# EAGLE board Tractive System Board Rev4 (EAGLE 9.6.2)
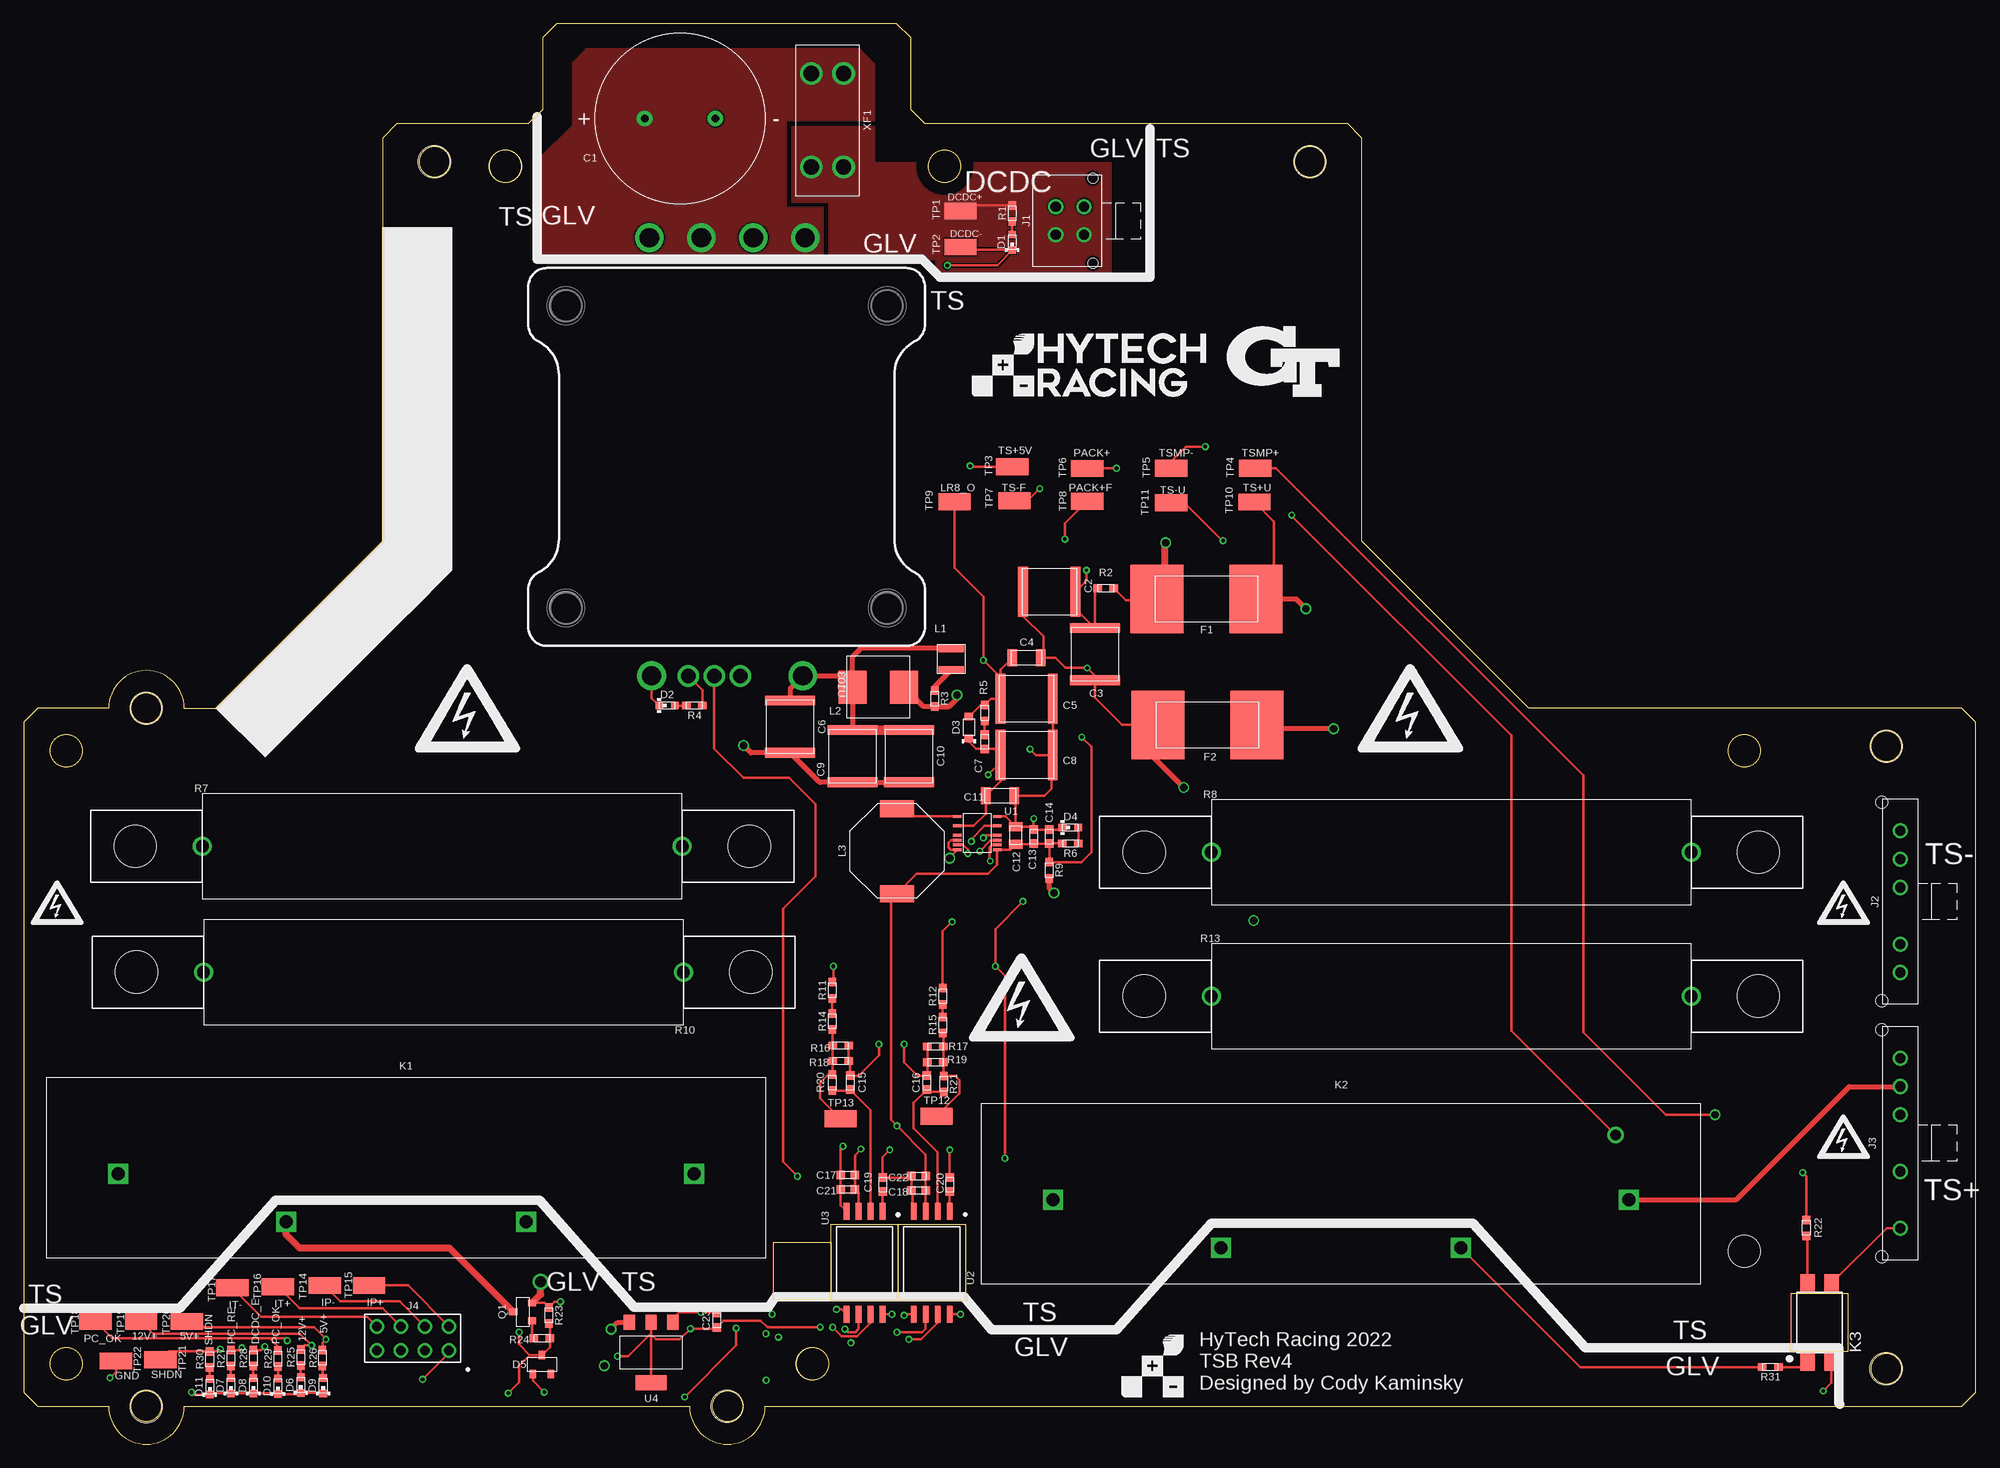
[diagram p4: board, top side]
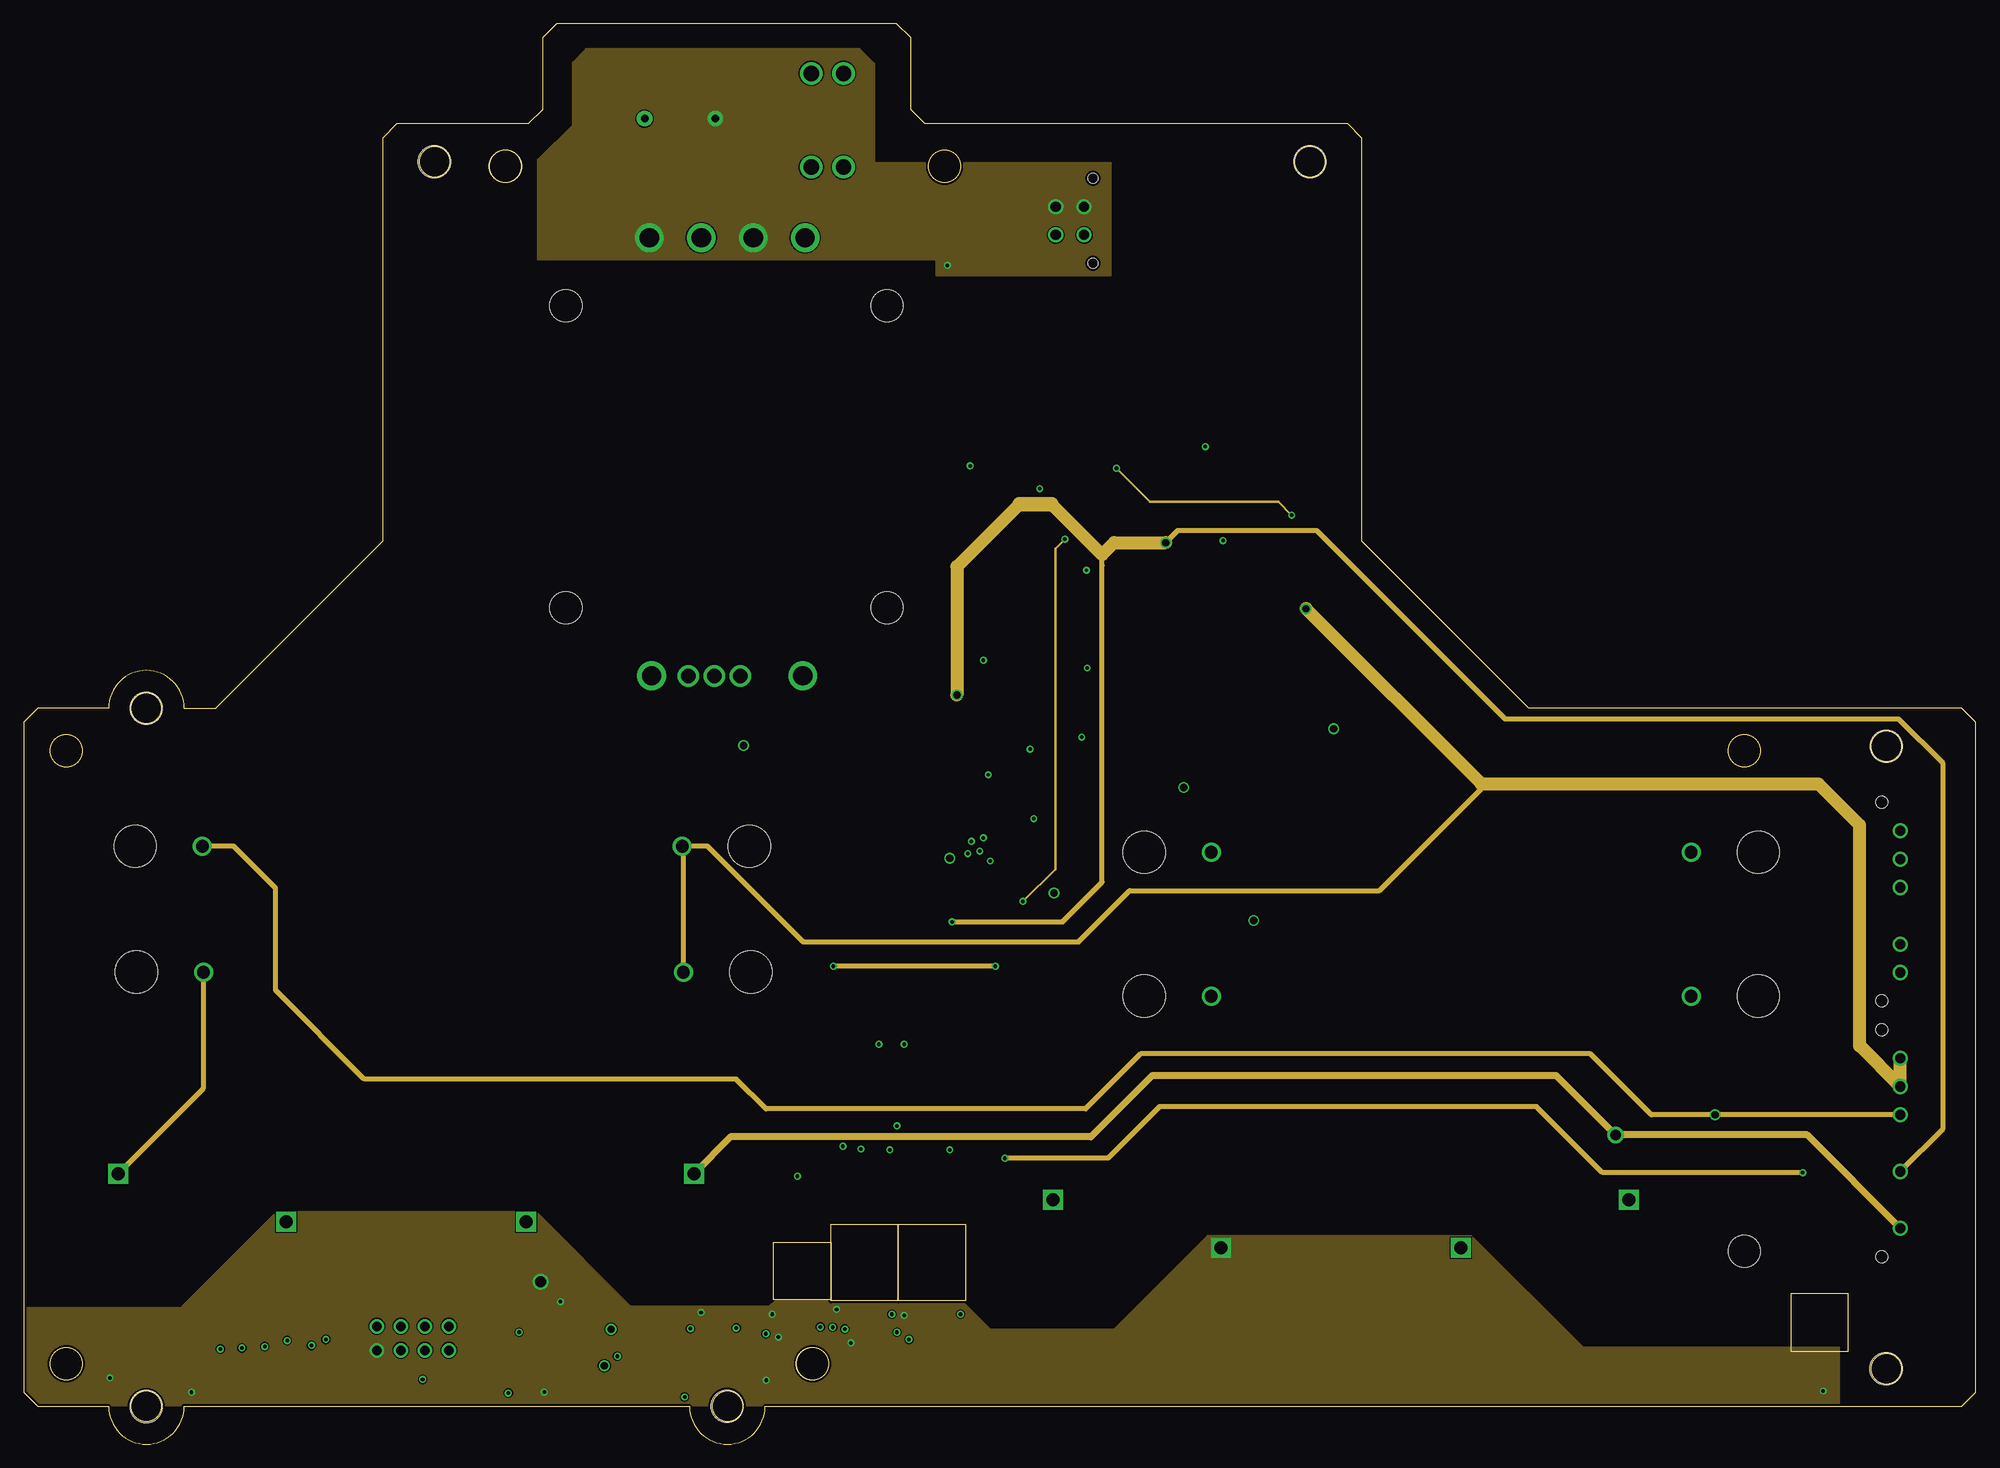
[diagram p5: board, inner layer Route2]
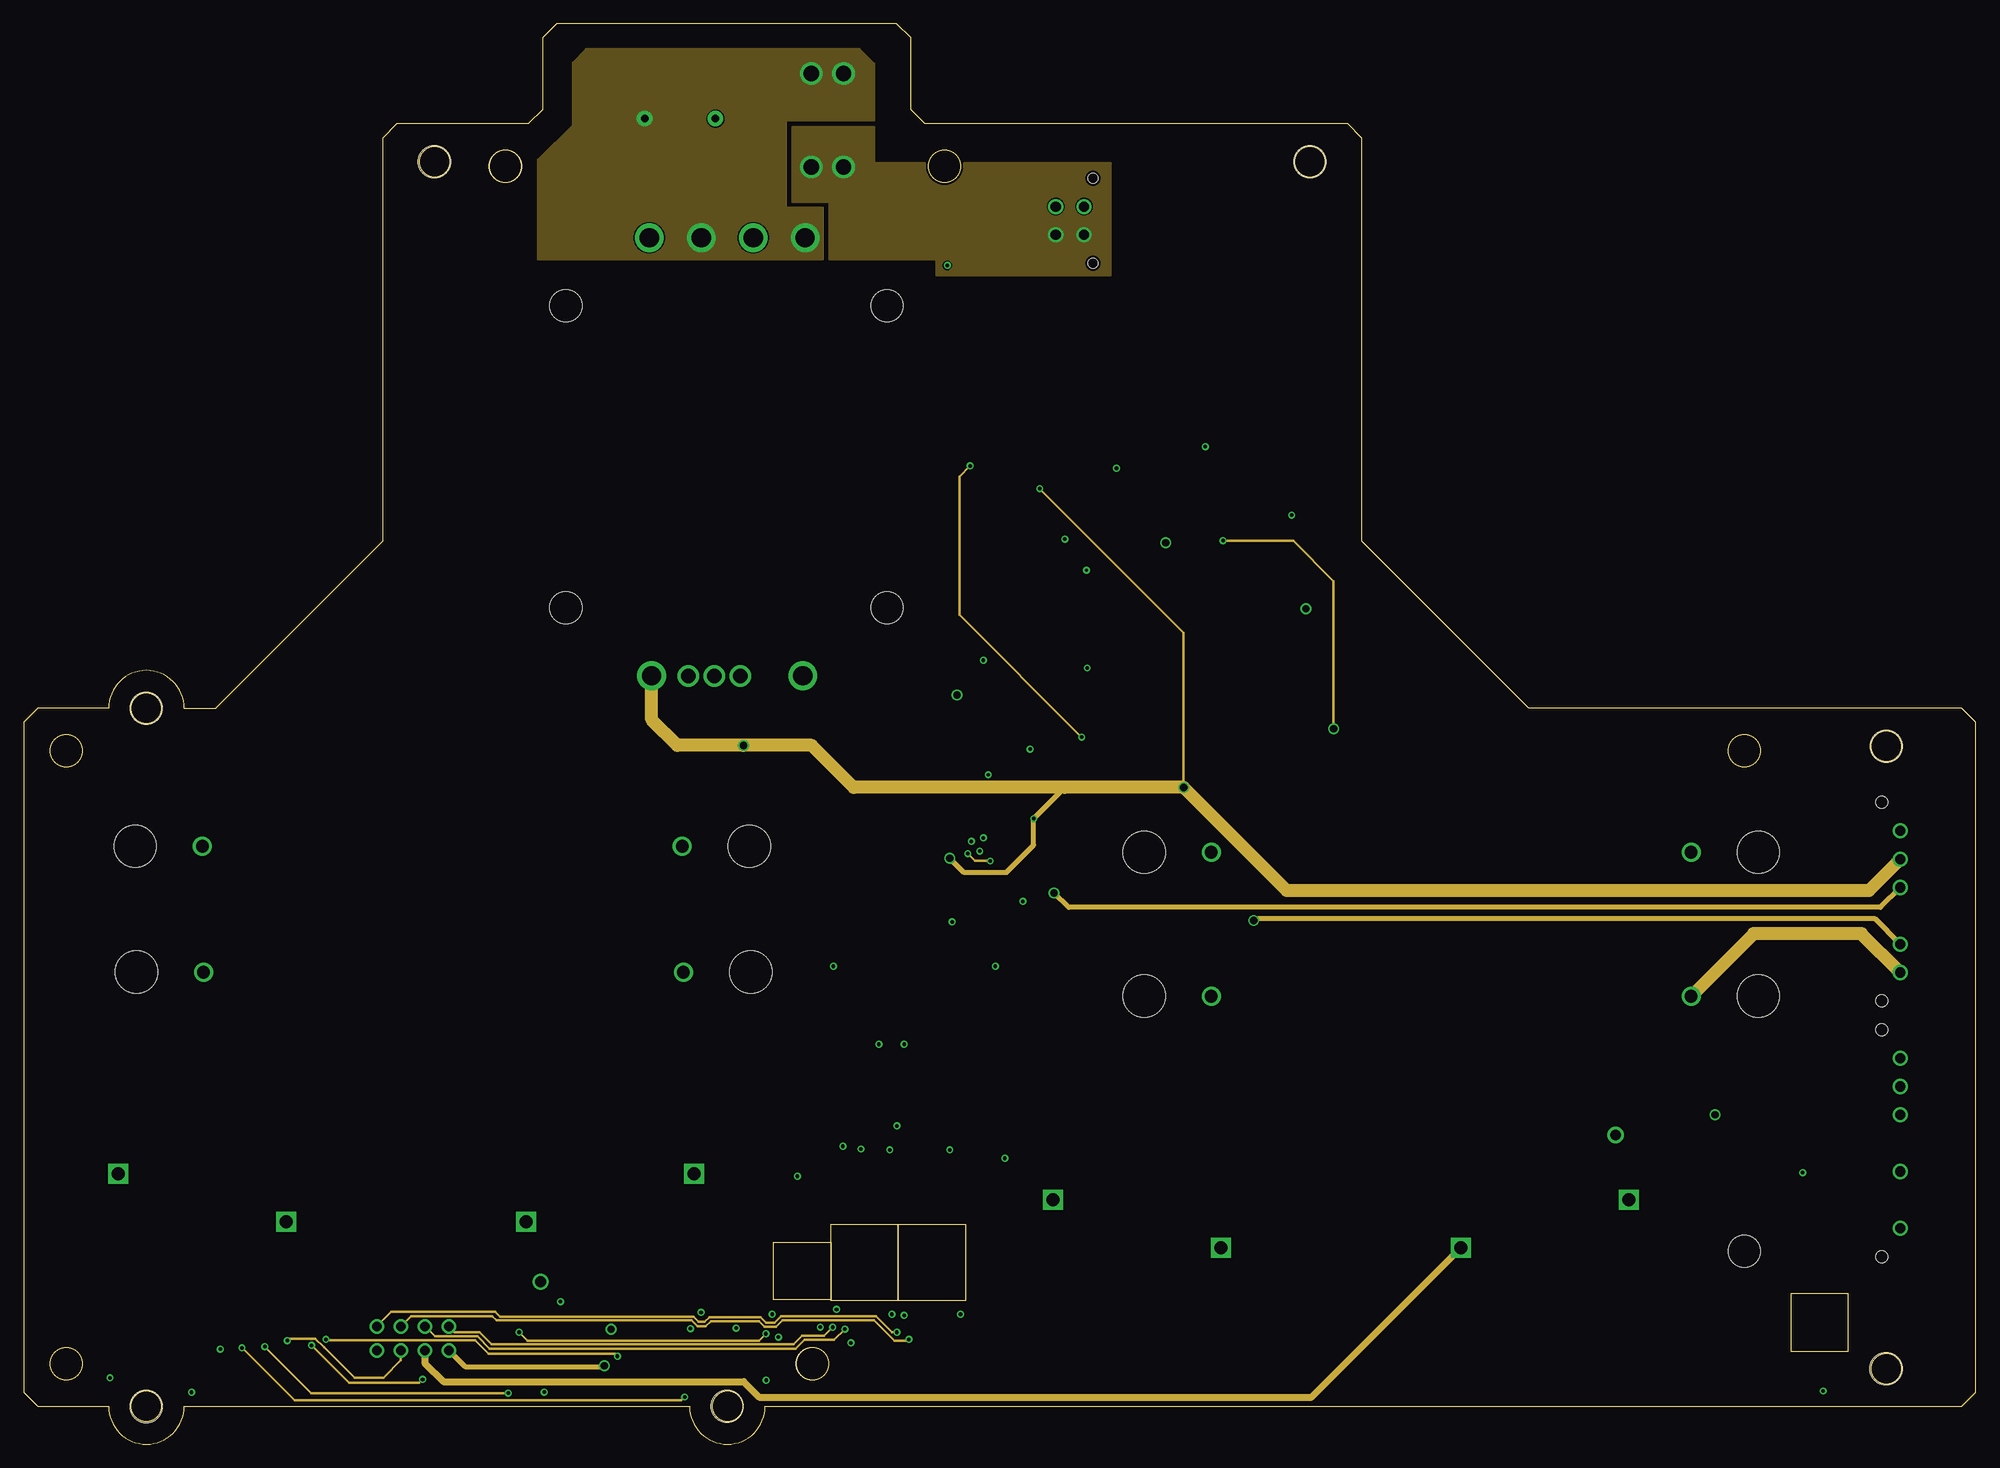
[diagram p6: board, inner layer Route15]
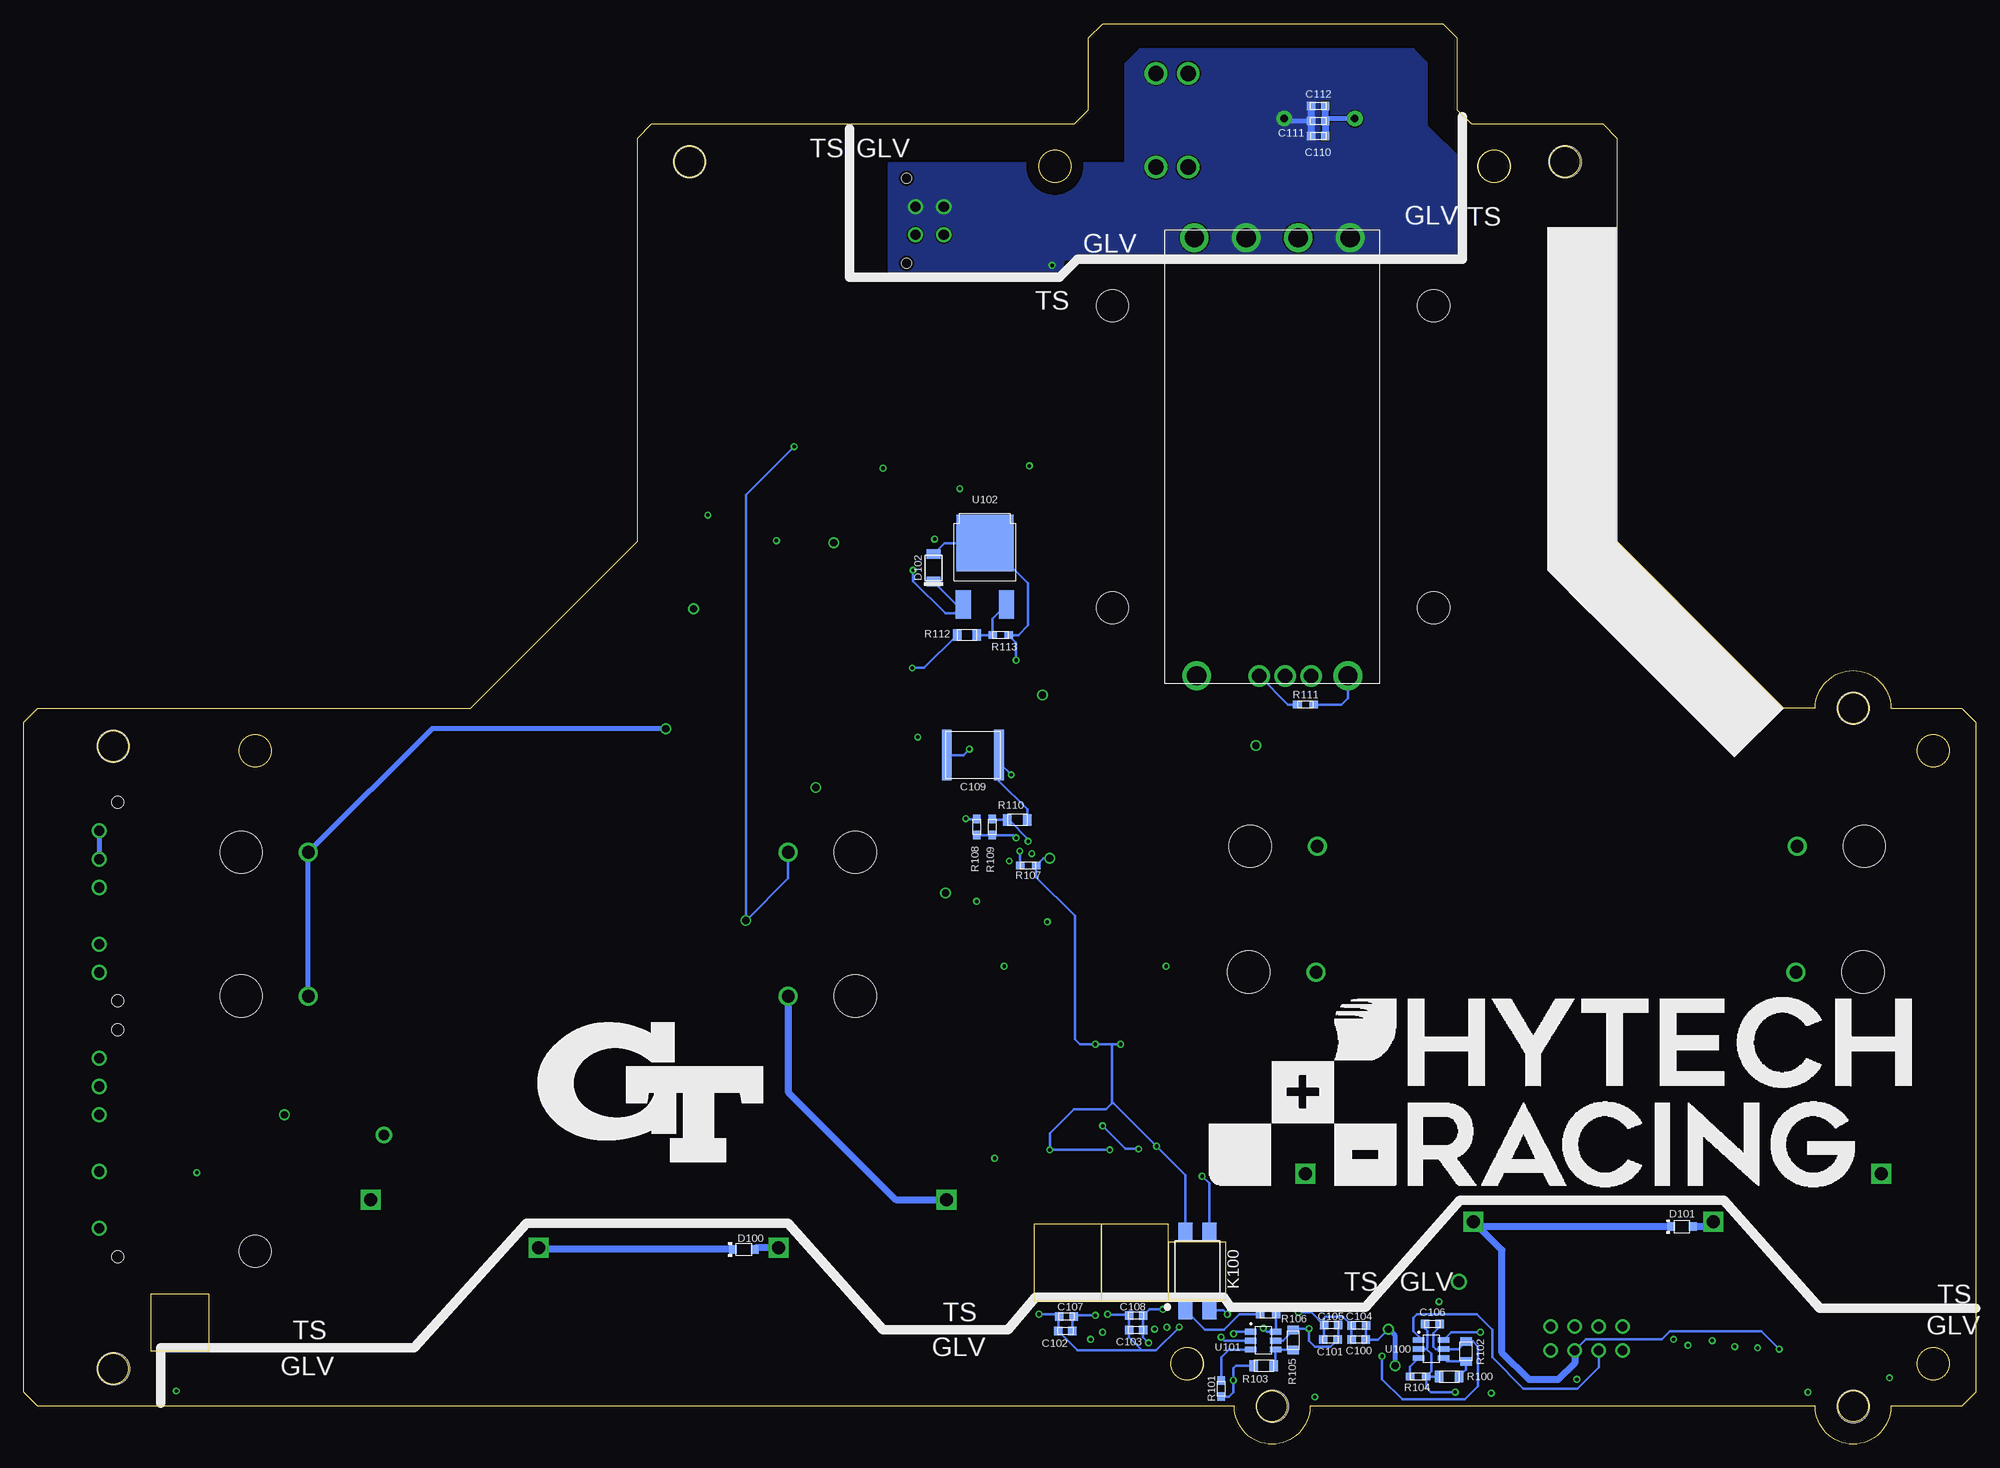
[diagram p7: board, bottom side, seen from below]

Size 206.67 x 150.35 mm. Coordinates in mm from the lower left corner, seen from the top.
Outline: 0,76.39 0,5.5 1.5,4 9,4 arc180 17,4 70.5,4 arc180 78.5,4 205.17,4 206.67,5.5 206.67,76.39 205.17,77.89 159.35,77.89 141.67,95.57 141.67,138.24 140.17,139.74 95.42,139.74 93.92,141.24 93.92,148.85 92.42,150.35 56.42,150.35 54.92,148.85 54.92,141.24 53.42,139.74 39.5,139.74 38,138.24 38,95.57 20.32,77.89 17,77.89 arc180 9,77.89 1.5,77.89 0,76.39
Outline: circle at 4.5,73.39 radius 1.7
Outline: circle at 4.5,8.5 radius 1.7
Outline: circle at 83.5,8.5 radius 1.7
Outline: circle at 182.17,73.39 radius 1.7
Outline: circle at 51,135.24 radius 1.7
Outline: circle at 97.5,135.24 radius 1.7
Outline: circle at 136.17,135.74 radius 1.6
Outline: circle at 197.17,73.89 radius 1.6
Outline: circle at 197.17,8 radius 1.6
Outline: circle at 13,4 radius 1.6
Outline: circle at 13,77.89 radius 1.6
Outline: circle at 43.5,135.74 radius 1.6
Outline: circle at 74.5,4 radius 1.6
Copper layers (1+2*15+16): Top 0.035mm / dielectric 0.22mm / Route2 0.035mm / dielectric 39mil / Route15 0.035mm / dielectric 0.22mm / Bottom 0.035mm
Design rules "Advanced Circuits (4 Layer)": minimum track width 5mil, minimum drill 10mil, track to track 5mil, track to pad 5mil, pad to pad 5mil, via to via 5mil, smd to smd 5mil, copper to edge 10mil, drill to drill 6mil, minimum pad ring 7mil, minimum via ring 7mil, stop-mask expansion 2.5mil, vias tented up to drill 30mil, thermal gap 10mil

## Footprints (pad centres in the part's own frame; a part is rotated, then mirrored left to right if it is on the bottom)
MOUNTING_M3 = hole 3.4: 0,0
EKYC*MM = drill 0.8 pad 1.651: + 3.75,0; - -3.75,0
2220-CAP = smd 1.05 x 5.3: 1 -2.775,0; 2 2.775,0
1206-CAP = smd 1 x 1.8: 1 -1.5,0; 2 1.5,0
0603-CAP = smd 0.9 x 0.9: 1 -0.75,0; 2 0.75,0
0805-CAP = smd 0.95 x 1.4: 1 -0.925,0; 2 0.925,0
0603-LED = smd 0.8 x 0.8: 1 -0.825,0; 2 0.825,0
SOD-323 = smd 0.8 x 0.9: A -1.15,0; C 1.15,0
SOT-23 = smd 0.711 x 0.889: 1 -0.94,-1.003; 2 0.94,-1.003; 3 0,1.003
SOD123F = smd 1 x 1.5: A -1.45,0; C 1.45,0
0885 = smd 5.6 x 7.23: 1 -5.25,0; 2 5.25,0
MOLEX_MICROFIT_PTH_VERTICAL_04_DUAL = drill 1.067: 1 1.499,-2.997; 2 -1.499,-2.997; 3 1.499,0; 4 -1.499,0 | hole 1.067: 4.496,0.94; -4.496,0.94
MOLEX_MICROFIT_PTH_VERTICAL_06_SINGLE_SPACED = drill 1.067: 1 -7.493,0; 2 -4.496,0; 3 -1.499,0; 4 4.496,0; 5 7.493,0 | hole 1.27: 10.503,-1.956; -10.503,-1.956
MOLEX_MICROFIT_PTH_VERTICAL_07_SINGLE_SPACED = drill 1.067: 1 -8.992,0; 2 -5.994,0; 3 -2.997,0; 4 2.997,0; 5 8.992,0 | hole 1.27: 12.002,-1.956; -12.002,-1.956
FLEX_STACK_PTH_08_DUAL = drill 1.016: 1 -3.81,1.27; 2 -1.27,1.27; 3 1.27,1.27; 4 3.81,1.27; 5 -3.81,-1.27; 6 -1.27,-1.27; 7 1.27,-1.27; 8 3.81,-1.27
335X = drill 1.397 square: 1 30.48,0; 2 12.7,-5.08; 3 -12.7,-5.08; 4 -30.48,0
DIP-4_AIRGAP = smd 1.5 x 1.9: 1 -1.27,-4.15; 2 1.27,-4.15; 3 -1.27,4.15; 4 1.27,4.15
PA4334 = smd 0.8 x 2.7: 1 -1.15,0; 2 1.15,0
WE-LMHI = smd 2.95 x 3.5: 1 -2.725,0; 2 2.725,0
SRU1048 = smd 1.8 x 3.6: 1 -4.5,0; 2 4.5,0
0603-RES = smd 0.9 x 0.8: 1 -0.85,0; 2 0.85,0
B20 = drill 1.35: 1 25.4,0; 2 -25.4,0 | hole 4.5: -32.51,0; 32.51,0
0805-RES = smd 0.9 x 1.2: 1 -1.05,0; 2 1.05,0
MICRO_MINIATURE = smd 3.429 x 1.778: 1 0,0
MSE16(12) = smd 0.309 x 0.902: 1 -1.75,-2.102; 3 -0.75,-2.102; 5 0.25,-2.102; 6 0.75,-2.102; 7 1.25,-2.102; 8 1.75,-2.102; 9 1.75,2.102; 10 1.25,2.102; 11 0.75,2.102; 12 0.25,2.102; 14 -0.75,2.102; 16 -1.75,2.102
SOIC-08(WIDE,0.295")-AIRGAP = smd 0.6 x 1.8: 1 -1.905,-5.45; 2 -0.635,-5.45; 3 0.635,-5.45; 4 1.905,-5.45; 5 1.905,5.45; 6 0.635,5.45; 7 -0.635,5.45; 8 -1.905,5.45
SOT223 = smd 1.2 x 1.6: 1 -2.3,-3.2; 2 0,-3.2; 3 2.3,-3.2 | smd 3.3 x 1.6: 4 0,3.2
SOT-23-6 = smd 0.62 x 1.22: 1 -0.95,-1.31; 2 0,-1.31; 3 0.95,-1.31; 4 -0.95,1.31; 5 0,1.31; 6 0.95,1.31
DPAK(2-7K1S) = smd 1.6 x 3: 1 -2.3,-3.5; 3 2.3,-3.5 | smd 6 x 6: 2 0,3
DCM4623 = drill 2.03 pad 2.79: 1 -23.19,8; 5 -23.19,-8; 6 23.19,8.25; 7 23.19,2.75; 8 23.19,-2.75; 9 23.19,-8.25 | drill 1.52 pad 2.02: 2 -23.19,1.38; 3 -23.19,-1.38; 4 -23.19,-4.13
3568 = drill 1.6: 1 -4.953,1.702; 2 -4.953,-1.702; 3 4.953,-1.702; 4 4.953,1.702

## Placement (x,y rotation side)
$$$$$$U$5  [HV_LARGE]  46.99,77.89 0 top
$$$$$$U$6  [HV_1.00"]  146.81,77.89 0 top
$$$$$$U$7  [MOUNTING_M3]  197.17,73.88 0 top
$$$$$$U$8  [MOUNTING_M3]  4.5,73.4 0 top
$$$$$$U$9  [MOUNTING_M3]  182.17,73.4 0 top
$$$$$$U$10  [HV_0.50"]  192.66,57.32 0 top
$$$$U$1  [MOUNTING_M3]  43.49,135.74 0 top
$$$$U$2  [MOUNTING_M3]  136.15,135.74 0 top
$$$$U$3  [MOUNTING_M3]  91.42,88.53 0 top
$$$$U$4  [MOUNTING_M3]  12.99,77.91 0 top
$$$$U$5  [GLV]  107.7,10.33 0 top
$$$$U$6  [MOUNTING_M3]  4.5,8.5 0 top
$$$$U$7  [LOGO_HYTECH_SQUARE_0.28"]  119.51,8.3 0 top
$$$$U$8  [GLV]  176.66,8.3 0 top
$$$$U$9  [MOUNTING_M3]  197.16,7.98 0 top
$$$$U$10  [MOUNTING_M3]  12.98,3.99 0 top
$$$$U$11  [HV_0.50"]  3.56,57.32 0 top
$$$$U$12  [HV_LARGE]  105.66,47.29 0 top
$$$$U$13  [MOUNTING_M3]  182.17,20.41 0 top
$$$$U$14  [TS]  65.1,17.24 0 top
$$$$U$15  [GLV]  58.17,17.24 0 top
$$$$U$16  [TS]  2.29,15.92 0 top
$$$$U$17  [GLV]  2.41,12.61 0 top
$$$$U$18  [MOUNTING_M3]  83.49,8.5 0 top
$$$$U$19  [MOUNTING_M3]  74.48,4 0 top
$$U$1  [TS]  121.67,137.2 0 top
$$U$2  [MOUNTING_M3]  51,135.24 0 top
$$U$3  [MOUNTING_M3]  97.5,135.24 0 top
$$U$4  [GLV]  57.66,130.09 0 top
$$U$5  [MOUNTING_M3]  57.4,120.49 0 top
$$U$6  [MOUNTING_M3]  91.42,120.49 0 top
$$U$7  [LOGO_GT_0.50"]  133.35,114.6 0 top
C1  CAPACITOR_POLAR__3600UF  [EKYC*MM]  69.49,140.3 180 top
C2  CAPACITOR_2220_630V_0.1UF  [2220-CAP]  108.58,90.21 180 top
C3  CAPACITOR_2220_630V_1UF  [2220-CAP]  113.41,83.61 270 top
C4  CAPACITOR_1206_250V_0.1UF  [1206-CAP]  106.17,83.23 0 top
C5  CAPACITOR_2220_250V_1UF  [2220-CAP]  106.17,78.91 0 top
C6  CAPACITOR_2220_630V_1UF  [2220-CAP]  81.15,75.93 270 top
C7  CAPACITOR_0603_10V_10NF  [0603-CAP]  101.73,74.34 90 top
C8  CAPACITOR_2220_250V_1UF  [2220-CAP]  106.17,72.94 0 top
C9  CAPACITOR_2220_630V_1UF  [2220-CAP]  87.76,72.81 270 top
C10  CAPACITOR_2220_630V_0.1UF  [2220-CAP]  93.73,72.81 270 top
C11  CAPACITOR_1206_250V_0.1UF  [1206-CAP]  103.38,68.62 0 top
C12  CAPACITOR_0805_25V_22UF  [0805-CAP]  105.03,64.43 90 top
C13  CAPACITOR_0603_25V_1UF  [0603-CAP]  106.93,64.3 90 top
C14  CAPACITOR_0603_25V_0.1UF  [0603-CAP]  108.58,64.3 90 top
C15  CAPACITOR_0603_10V_10NF  [0603-CAP]  87.5,38.27 90 top
C16  CAPACITOR_0603_10V_10NF  [0603-CAP]  95.63,38.27 90 top
C17  CAPACITOR_0603_10V_1UF  [0603-CAP]  87.25,28.49 180 top
C18  CAPACITOR_0603_10V_1UF  [0603-CAP]  94.74,28.36 180 top
C19  CAPACITOR_0603_10V_1UF  [0603-CAP]  90.93,27.47 90 top
C20  CAPACITOR_0603_10V_1UF  [0603-CAP]  98.04,27.47 90 top
C21  CAPACITOR_0603_10V_1UF  [0603-CAP]  87.25,26.97 180 top
C22  CAPACITOR_0603_10V_1UF  [0603-CAP]  94.74,26.84 180 top
C23  CAPACITOR_0603_10V_0.1UF  [0603-CAP]  73.41,13.12 90 top
C100  CAPACITOR_0603_25V_0.1UF  [0603-CAP]  65.34,11.06 180 bottom
C101  CAPACITOR_0603_10V_4.7UF  [0603-CAP]  68.33,11.09 180 bottom
C102  CAPACITOR_0603_10V_0.1UF  [0603-CAP]  96.39,11.98 0 bottom
C103  CAPACITOR_0603_10V_1UF  [0603-CAP]  88.9,12.11 0 bottom
C104  CAPACITOR_0603_25V_1UF  [0603-CAP]  65.32,12.59 180 bottom
C105  CAPACITOR_0603_10V_0.1UF  [0603-CAP]  68.26,12.6 180 bottom
C106  CAPACITOR_0603_10V_0.1UF  [0603-CAP]  57.53,12.74 180 bottom
C107  CAPACITOR_0603_10V_1UF  [0603-CAP]  96.27,13.5 0 bottom
C108  CAPACITOR_0603_10V_0.1UF  [0603-CAP]  88.9,13.63 0 bottom
C109  CAPACITOR_2220_250V_1UF  [2220-CAP]  106.17,72.94 180 bottom
C110  CAPACITOR_0603_25V_10UF  [0603-CAP]  69.62,138.47 0 bottom
C111  CAPACITOR_0603_25V_1UF  [0603-CAP]  69.62,140.02 0 bottom
C112  CAPACITOR_0603_35V_0.1UF  [0603-CAP]  69.62,141.61 0 bottom
D1  LED_0603_BLUE  [0603-LED]  104.65,127.22 90 top
D2  LED_0603_RED  [0603-LED]  68.1,78.19 0 top
D3  SCHOTTKY_SOD323_30V  [SOD-323]  100.08,75.86 270 top
D4  LED_0603_BLUE  [0603-LED]  110.8,65.26 0 top
D5  TVS_8V  [SOT-23]  54.86,8.42 0 top
D6  LED_0603_BLUE  [0603-LED]  29.34,6.26 90 top
D7  LED_0603_WHITE  [0603-LED]  21.96,6.2 90 top
D8  LED_0603_YELLOW  [0603-LED]  24.33,6.2 90 top
D9  LED_0603_BLUE  [0603-LED]  31.71,6.2 90 top
D10  LED_0603_GREEN  [0603-LED]  26.92,6.14 90 top
D11  LED_0603_ORANGE  [0603-LED]  19.71,6.07 90 top
D100  SCHOTTKY_SOD323_30V  [SOD-323]  130.43,20.62 180 bottom
D101  SCHOTTKY_SOD323_30V  [SOD-323]  31.11,23.03 180 bottom
D102  RECTIFIER_400V_SOD123  [SOD123F]  110.36,92.75 270 bottom
F1  FUSE_0885_1.25  [0885]  125.22,89.45 180 top
F2  FUSE_0885_1.25  [0885]  125.33,76.12 180 top
J1  CONNECTOR-4__  [MOLEX_MICROFIT_PTH_VERTICAL_04_DUAL]  112.26,129.48 270 top
J2  CONNECTOR-5_MICRO_V6S_  [MOLEX_MICROFIT_PTH_VERTICAL_06_SINGLE_SPACED]  198.67,57.42 270 top
J3  CONNECTOR-5_MICRO_V7S_  [MOLEX_MICROFIT_PTH_VERTICAL_07_SINGLE_SPACED]  198.66,31.86 270 top
J4  CONNECTOR-8_S_S  [FLEX_STACK_PTH_08_DUAL]  41.2,11.2 180 top
K1  RELAY_SPST_NO_3550_12  [335X]  40.48,28.64 0 top
K2  RELAY_SPST_NC_POLARIZED_3550_12  [335X]  139.45,25.88 0 top
K3  RELAY_SOLIDSTATE_NO_AG  [DIP-4_AIRGAP]  190.12,12.87 0 top
K100  RELAY_SOLIDSTATE_NC_AG  [DIP-4_AIRGAP]  82.42,18.33 0 bottom
L1  INDUCTOR_PA4334_3.6UH  [PA4334]  98.2,83.09 270 top
L2  INDUCTOR_WELMHI_56UH  [WE-LMHI]  90.47,80.13 0 top
L3  INDUCTOR_SRU1048_330UH  [SRU1048]  92.46,62.78 270 top
Q1  TRANSISTOR_N_MOS__PMV15ENEA  [SOT-23]  52.83,14.01 90 top
R1  RESISTOR_0603_1K  [0603-RES]  104.65,130.27 90 top
R2  RESISTOR_0603_39  [0603-RES]  114.55,90.59 180 top
R3  RESISTOR_0603_1.62  [0603-RES]  96.46,78.91 270 top
R4  RESISTOR_0603_1K  [0603-RES]  71.01,78.17 180 top
R5  RESISTOR_0603_10K  [0603-RES]  101.73,77.38 270 top
R6  RESISTOR_0603_1K  [0603-RES]  110.81,63.58 180 top
R7  RESISTOR_B20_10K  [B20]  44.32,63.29 0 top
R8  RESISTOR_B20_10K  [B20]  151.13,62.65 0 top
R9  RESISTOR_0603_180  [0603-RES]  108.58,60.75 270 top
R10  RESISTOR_B20_750  [B20]  44.45,49.95 180 top
R11  RESISTOR_0603_HV750K  [0603-RES]  85.6,48.05 90 top
R12  RESISTOR_0603_HV750K  [0603-RES]  97.28,47.41 90 top
R13  RESISTOR_B20_10K  [B20]  151.13,47.41 0 top
R14  RESISTOR_0603_360K  [0603-RES]  85.6,44.75 90 top
R15  RESISTOR_0603_360K  [0603-RES]  97.28,44.36 90 top
R16  RESISTOR_0603_HV75K  [0603-RES]  86.49,42.21 180 top
R17  RESISTOR_0603_HV75K  [0603-RES]  96.52,42.08 0 top
R18  RESISTOR_0603_HV75K  [0603-RES]  86.49,40.55 180 top
R19  RESISTOR_0603_HV75K  [0603-RES]  96.52,40.43 0 top
R20  RESISTOR_0603_33.2K  [0603-RES]  85.6,38.27 270 top
R21  RESISTOR_0603_33.2K  [0603-RES]  97.41,38.14 270 top
R22  RESISTOR_0603_39  [0603-RES]  188.72,22.9 270 top
R23  RESISTOR_0603_10K  [0603-RES]  55.63,13.63 270 top
R24  RESISTOR_0603_10  [0603-RES]  54.86,11.22 180 top
R25  RESISTOR_0603_1K  [0603-RES]  29.34,9.19 90 top
R26  RESISTOR_0603_1K  [0603-RES]  31.64,9.13 270 top
R27  RESISTOR_0603_1K  [0603-RES]  21.94,9.12 90 top
R28  RESISTOR_0603_1K  [0603-RES]  24.31,9.11 90 top
R29  RESISTOR_0603_1K  [0603-RES]  26.92,9.06 90 top
R30  RESISTOR_0603_1K  [0603-RES]  19.7,8.98 90 top
R31  RESISTOR_0603_1K  [0603-RES]  184.91,8.17 180 top
R100  RESISTOR_0805_1M  [0805-RES]  55.75,7.15 0 bottom
R101  RESISTOR_0603_75K  [0603-RES]  79.88,5.88 90 bottom
R102  RESISTOR_0805_523K  [0805-RES]  53.97,9.82 90 bottom
R103  RESISTOR_0805_1M  [0805-RES]  75.38,8.31 0 bottom
R104  RESISTOR_0603_75K  [0603-RES]  59.05,7.15 180 bottom
R105  RESISTOR_0805_523K  [0805-RES]  72.26,11.02 90 bottom
R106  RESISTOR_0603_1K  [0603-RES]  74.93,13.76 180 bottom
R107  RESISTOR_0603_75K  [0603-RES]  100.33,61.26 180 bottom
R108  RESISTOR_0603_8.35K  [0603-RES]  105.79,65.32 270 bottom
R109  RESISTOR_0603_13.3K  [0603-RES]  104.14,65.32 90 bottom
R110  RESISTOR_0805_976K  [0805-RES]  101.47,66.08 0 bottom
R111  RESISTOR_0603_DNP  [0603-RES]  70.97,78.29 0 bottom
R112  RESISTOR_0805_HV365K  [0805-RES]  106.81,85.64 0 bottom
R113  RESISTOR_0603_3.32K  [0603-RES]  103.25,85.64 0 bottom
TP1  TEST_POINT  [MICRO_MINIATURE]  99.19,130.52 0 top
TP2  TEST_POINT  [MICRO_MINIATURE]  99.19,126.71 0 top
TP3  TEST_POINT  [MICRO_MINIATURE]  104.65,103.46 0 top
TP4  TEST_POINT  [MICRO_MINIATURE]  130.36,103.31 0 top
TP5  TEST_POINT  [MICRO_MINIATURE]  121.47,103.28 0 top
TP6  TEST_POINT  [MICRO_MINIATURE]  112.58,103.26 0 top
TP7  TEST_POINT  [MICRO_MINIATURE]  104.9,99.86 0 top
TP8  TEST_POINT  [MICRO_MINIATURE]  112.58,99.81 0 top
TP9  TEST_POINT  [MICRO_MINIATURE]  98.55,99.74 0 top
TP10  TEST_POINT  [MICRO_MINIATURE]  130.3,99.73 0 top
TP11  TEST_POINT  [MICRO_MINIATURE]  121.47,99.63 0 top
TP12  TEST_POINT  [MICRO_MINIATURE]  96.65,34.71 0 top
TP13  TEST_POINT  [MICRO_MINIATURE]  86.49,34.46 0 top
TP14  TEST_POINT  [MICRO_MINIATURE]  31.88,16.81 0 top
TP15  TEST_POINT  [MICRO_MINIATURE]  36.58,16.81 0 top
TP16  TEST_POINT  [MICRO_MINIATURE]  26.92,16.68 0 top
TP17  TEST_POINT  [MICRO_MINIATURE]  22.1,16.55 0 top
TP18  TEST_POINT  [MICRO_MINIATURE]  7.62,13 0 top
TP19  TEST_POINT  [MICRO_MINIATURE]  12.45,13 0 top
TP20  TEST_POINT  [MICRO_MINIATURE]  17.27,13 0 top
TP21  TEST_POINT  [MICRO_MINIATURE]  14.48,8.93 0 top
TP22  TEST_POINT  [MICRO_MINIATURE]  9.78,8.8 0 top
U1  LTC3639  [MSE16(12)]  100.96,64.68 270 top
U2  ISO224B_AIRGAP  [SOIC-08(WIDE,0.295")-AIRGAP]  96.14,19.23 180 top
U3  ISO224B_AIRGAP  [SOIC-08(WIDE,0.295")-AIRGAP]  89.03,19.22 180 top
U4  VOLTAGE_REGULATOR_SOT223_5V  [SOT223]  66.42,9.69 180 top
U100  LTC6994-2  [SOT-23-6]  57.66,10.07 270 bottom
U101  LTC6994-2  [SOT-23-6]  75.45,10.97 270 bottom
U102  VOLTAGE_REGULATOR_ADJ_LR8_DPAK  [DPAK(2-7K1S)]  104.9,92.37 0 bottom
U103  DCM4623TD2J13D0T70  [DCM4623]  74.49,104.51 90 bottom
U$1  [GLV]  115.7,137.2 0 top
U$5  [TS]  52.07,129.96 0 top
U$6  [GLV]  91.69,127.12 0 top
U$7  [TS]  97.79,121.07 0 top
U$8  [LOGO_HYTECH_MEDIUM]  100.33,110.91 0 top
U$9  [MOUNTING_M3]  57.4,88.53 0 top
U$10  [HV_0.50"]  192.66,32.55 0 top
U$11  [TS]  107.57,14.01 0 top
U$12  [TS]  176.4,12.11 0 top
U$100  [LOGO_HYTECH_EXTRA_LARGE]  81.28,27.09 0 bottom
U$101  [LOGO_GT_LARGE]  140.33,37.25 0 bottom
XF1  FUSE_HOLDER_MINIBLADEPTH  [3568]  85.09,140.12 270 top

## Tracks (layer width: path | path; a pad name or v marks a point on that pad's centre or on a via)
+5V  (via drill 0.38)
  Top 0.254: U4.4 66.42,11.6 | 66.42,11.6 U4.2 66.42,11.73 64.01,9.31 v62.86,9.31 | 66.42,11.6 66.93,11.09 69.45,11.09 v70.59,12.23 73.26,12.23 C23.1 74.09,13.06 78.04,13.06 78.69,12.41 78.79,12.41 78.8,12.4 v84.34,12.4 | R26.1 31.64,10.72 v32,11.09 30.73,12.36 17.91,12.36 TP20.1 | v99.19,13.76 98.06,13.76 U2.8 | v91.92,13.76 91.89,13.76 91.88,13.75 90.88,13.75 90.89,13.77 U3.8
  Route15 0.254: v32,11.09 32.1,10.99 47.78,10.99 49.21,9.57 62.61,9.57 v62.86,9.31
  Bottom 0.254: C105.1 67.51,11.16 C101.1 67.58,11.07 68.33,10.32 69.96,10.32 70.59,10.95 v70.59,12.23 72.11,12.23 R105.2 73.37,10.97 U101.5 | v99.19,13.76 97.27,13.76 C107.1 97.14,13.38 C102.1 95.08,9.92 88.26,9.92 | v91.92,13.76 91.89,13.73 89.75,13.73 C108.1 C103.1 89.65,11.31 88.26,9.92 | v84.34,12.4 86.81,9.92 88.26,9.92 | v62.86,9.31 62.86,6.9 60.71,4.74 54.1,4.74 52.7,6.14 52.7,10.33 53.25,10.87 R102.2 54.77,10.07 U100.5 57.15,10.07 57.4,10.33 57.4,11.74 56.78,12.36 C106.1
+12V  (via drill 0.38, 0.76)
  Top 0.254: R25.2 29.76,10.46 v30.48,10.46 29.23,11.7 13.74,11.7 TP19.1 | v42.24,6.86 45.01,9.63 J4.1
  Top 0.508: v62.18,12.18 62.89,12.89 U4.3
  Route15 0.254: v30.48,10.46 34.45,6.48 41.86,6.48 v42.24,6.86
  Route15 0.508: v61.47,8.3 61.39,8.22 46.72,8.22 J4.1
  Bottom 0.254: C104.1 64.59,12.57 C100.1 63.3,11.06 v62.18,12.18
  Bottom 0.508: v61.47,8.3 61.47,11.47 v62.18,12.18
DCDC+
  Top 0.254: TP1.1 99.78,131.12 R1.2
  pour Route15 (no thermals): 90.04,139.36 90.04,135.55 115.06,135.55 115.06,123.74 96.65,123.74 96.65,125.39 85.34,125.39 85.34,131.49 81.41,131.49 81.41,139.36
  pour Top (no thermals): 81.41,139.36 90.04,139.36 90.04,135.55 115.06,135.55 115.06,123.74 96.65,123.74 96.65,125.39 85.34,125.39 85.34,131.49 81.41,131.49
DCDC-  (via drill 0.38)
  Top 0.254: TP2.1 99.5,126.39 D1.1 104.71,126.39 103.07,124.76 v97.79,124.76
  Bottom 0.508: C111.1 72.96,140.02 C1.-
  Bottom 0.762: C110.1 70.37,138.48 C111.1 C112.1
  pour Bottom (no thermals): 54.48,135.93 58.17,139.61 58.17,146.22 59.56,147.62 88.52,147.62 90.04,146.09 90.04,135.55 115.06,135.55 115.06,123.74 96.65,123.74 96.65,125.39 54.48,125.39
  pour Route2 (no thermals): 54.48,135.93 58.17,139.61 58.17,146.22 59.56,147.62 88.52,147.62 90.04,146.09 90.04,135.55 115.06,135.55 115.06,123.74 96.65,123.74 96.65,125.39 54.48,125.39
DCDC_ENABLE  (via drill 0.38)
  Top 0.254: R23.2 55.71,12.69 R24.1 55.71,10.28 D5.3 53.58,9.43 | R28.2 25.16,9.96 v25.53,10.33 | v51.31,5.41 52.45,6.56 52.45,8.3 53.58,9.43 | v52.45,11.85 52.45,10.56 53.58,9.43
  Route15 0.254: v25.53,10.33 30.44,5.41 v51.31,5.41 | v52.45,11.85 53.33,10.97 77.86,10.97 v78.58,11.69
  Bottom 0.254: U100.4 55.52,11.85 v52.45,11.85 | v78.58,11.69 78.36,11.92 U101.1
ENABLE  (via drill 0.38)
  Top 0.254: v81.91,28.36 80.39,29.89 80.39,56.68 83.82,60.11 83.82,67.73 81.03,70.53 76.2,70.53 73.11,73.62 U103.3
  Bottom 0.254: K100.4 81.15,27.6 v81.91,28.36
GND  (via drill 0.38, 1.14)
  Top 0.254: Q1.2 55.15,14.95 R23.1 56.23,15.08 v56.84,15.08 | D9.1 31.64,5.44 D6.1 29.21,5.31 D10.1 26.86,5.37 D8.1 D7.1 19.84,5.37 D11.1 18.04,5.24 v17.78,5.5 | D5.1 53.92,6.7 v55.11,5.51 | TP22.1 9.78,7.66 v9.14,7.03 | v93.22,13.63 93.36,13.78 U2.5 | U4.1 68.72,13.26 69.41,13.95 v71.72,13.95 73.33,13.95 C23.2 | U3.5 86.61,14.28 v86.06,14.28 | K3.2 191.39,6.52 v190.5,5.63
  Top 0.762: Q1.2 54.74,15.85 v54.74,17.19
  Bottom 0.254: C100.2 66.09,12.57 C104.2 66.98,13.5 68.83,13.5 69.01,13.33 C105.2 | C101.2 69.01,11.16 C105.2 | v71.72,13.95 70.36,13.95 C105.2 | U101.2 78.31,10.97 78.31,10.96 79.53,10.96 v79.91,11.34 | C102.2 95.64,13.38 C107.2 95.39,13.63 v93.22,13.63 | v87.57,10.72 88.15,11.3 C103.2 C108.2 87.5,14.28 v86.06,14.28 | R103.1 78.35,8.31 78.61,8.04 v78.61,6.77 78.61,5.5 79.08,5.03 R101.1 | K100.2 79.67,14.18 v79.25,13.76 | 58.17,10.07 58.04,10.2 58.04,11.99 58.28,12.23 C106.2 | 58.17,10.07 U100.2 | R100.1 58.17,7.15 | 58.17,7.15 R104.1 57.66,7.7 57.66,9.57 58.17,10.07 | v55.11,5.51 57.67,5.51 58.17,6.01 58.17,7.15
  Bottom 0.762: K2.3 129.09,20.8 D100.A
  pour Route2 (no thermals): 0,5.5 0,14.39 16.64,14.39 26.8,24.55 54.18,24.55 54.18,24.55 54.29,24.55 54.29,24.53 64.26,14.55 78.94,14.55 79.63,15.25 99.23,15.25 102.38,12.11 115.44,12.11 125.35,22.01 153.29,22.01 165.1,10.2 192.15,10.2 192.15,4.11 1.4,4.11
IP+  (via drill 0.38)
  Top 0.254: U3.7 89.66,12.87 88.24,11.45 86.59,11.45 v85.65,12.38 | TP15.1 40.7,16.81 45.01,12.49 J4.5
  Route15 0.254: v85.65,12.38 84.74,11.47 82.42,11.47 81.52,10.57 49.54,10.57 48.26,11.85 45.63,11.85 J4.5
IP-  (via drill 0.38)
  Top 0.254: TP14.1 33.53,15.15 39.79,15.15 J4.6 | v86.94,12.18 87.25,11.87 88.05,11.87 88.39,12.2 U3.6
  Route15 0.254: v86.94,12.18 85.81,11.05 82.68,11.05 81.74,10.12 49.36,10.12 48.08,11.4 43.54,11.4 J4.6
IT+  (via drill 0.38)
  Top 0.254: v93.73,11.09 95.01,11.09 96.77,12.85 U2.7 | TP16.1 29.21,14.39 38.03,14.39 39.93,12.49 J4.7
  Route15 0.254: v93.73,11.09 93.6,10.96 92.2,10.96 90.03,13.13 80.36,13.13 79.67,12.45 78.44,12.45 77.85,13.04 72.77,13.04 72.22,12.49 71.35,12.49 70.73,13.11 50.05,13.11 49.59,13.57 41.01,13.57 J4.7
IT-  (via drill 0.38)
  Top 0.254: v92.46,11.85 95.12,11.85 95.5,12.23 U2.6 | TP17.1 25.15,13.5 36.38,13.5 37.39,12.49 J4.8
  Route15 0.254: v92.46,11.85 91.93,11.85 90.23,13.55 80.2,13.55 79.5,12.85 78.61,12.85 78.02,13.44 72.6,13.44 72.11,12.95 71.47,12.95 70.9,13.52 50.43,13.52 49.94,14.01 38.92,14.01 38.92,14 J4.8
LED+  (via drill 0.76)
  Top 0.508: v109.09,58.33 108.62,58.8 108.62,59.86
  Top 0.762: 108.62,59.86 R9.2
  Route15 0.508: J2.3 196.56,56.81 110.62,56.81 v109.09,58.33
LR8_O  (via drill 0.38)
  Top 0.254: D3.A 101.3,78.23 R5.1 102.4,78.91 C5.1 103.4,81.18 | 103.4,81.18 103.4,81.95 C4.1 | 103.4,81.18 v101.6,82.97 101.6,89.7 98.55,92.75 TP9.1
  Bottom 0.254: D102.A 109.19,95.37 U102.2 104.6,95.37 100.33,91.1 100.33,86.66 101.35,85.64 R113.2 101.6,84.84 v101.6,82.97
N$1
  Top 0.254: R14.2 R11.1
N$2  (via drill 0.38)
  Top 0.254: U1.12 101.86,64.43 v101.6,64.18
  Bottom 0.254: R108.2 R109.1 101.89,64.47 v101.6,64.18
N$3
  Top 0.254: R24.2 53.83,11.4 Q1.1
N$4
  Bottom 0.254: R105.1 74.09,9.97 U101.6 74.14,8.5 R103.2
N$5  (via drill 0.38)
  Top 0.254: v100.33,63.8 100.33,64.05 101.71,65.43 U1.14
  Bottom 0.254: R109.2 104.05,66.08 R110.1 102.36,66.08 100.33,64.05 v100.33,63.8
N$6
  Bottom 0.254: R106.2 77.94,13.76 79.59,12.11 81.62,12.11 K100.1
N$7
  Top 0.254: R15.2 R12.1
N$8
  Bottom 0.254: R112.2 R113.1 104.1,87.37 U102.3
N$10
  Bottom 0.254: R104.2 59.9,8.19 U100.3
N$11
  Bottom 0.254: U100.6 55.99,8.77 R102.1 53.97,7.88 R100.2
N$14
  Bottom 0.254: R101.2 79.88,9.19 79.05,10.02 U101.3
N$15  (via drill 0.35)
  Top 0.254: v112.52,92.5 112.52,91.86 112.52,91.37 C2.1 111.36,88.43 C3.1 113.41,90.3 R2.2
  Bottom 0.254: v112.52,92.5 112.52,91.34 109.1,87.93 108.15,87.93 U102.1 107.93,88.87 D102.C
N$16  (via drill 0.38)
  Top 0.254: R27.2 22.88,9.97 v23.11,10.2 | v69.98,4.99 75.44,10.46 v75.44,12.29
  Route15 0.254: v23.11,10.2 28.68,4.64 69.62,4.64 v69.98,4.99
  Bottom 0.254: R106.1 74.08,11.98 U101.4 75.07,11.92 v75.44,12.29
N$17
  Top 0.254: R27.1 21.94,7.04 D7.2
N$18
  Top 0.254: R1.1 D1.2
N$22
  Top 0.254: D10.2 R29.1
N$24
  Top 0.254: R28.1 24.31,7.04 D8.2
N$25
  Top 0.254: R25.1 D6.2
N$29
  Top 0.508: R3.1 96.46,80.2 L1.2
N$30
  Top 0.254: R26.2 31.64,7.09 D9.2
N$31
  Top 0.254: R30.1 19.7,6.91 D11.2
N$35
  Top 0.254: R6.1 111.66,65.23 D4.2
N$39
  Top 0.508: 86.56,81.32 U103.1 81.15,79.97 C6.1 | 87.74,75.6 L2.1 87.74,83.34 88.64,84.24 L1.1
  Top 1.016: 86.56,81.32 L2.1 | 87.74,75.6 C9.1 C10.1
N$40
  Top 0.762: Q1.3 45.1,20.74 29.21,20.74 27.78,22.17 K1.3
  Bottom 0.762: K1.3 28.31,23.03 D101.A
N$43
  Top 0.254: D2.2 R4.2
N$44
  Top 0.254: R4.1 71.86,79.82 U103.4
N$45
  Bottom 0.254: R111.1 72.84,78.29 U103.2
N$46
  Bottom 0.508: C1.+ 68.59,140.3 C111.2
  Bottom 0.762: C112.2 C111.2 68.87,138.48 C110.2
  pour Top (no thermals): 54.48,125.39 54.48,135.93 58.17,139.61 58.17,146.22 59.56,147.62 88.52,147.62 90.04,146.09 90.04,140.12 80.64,140.12 80.64,130.85 84.58,130.85 84.58,125.39
  pour Route15 (no thermals): 58.17,139.61 58.17,146.22 59.56,147.62 88.52,147.62 90.04,146.09 90.04,140.12 80.64,140.12 80.64,130.85 84.58,130.85 84.58,125.39 54.48,125.39 54.48,135.93
N$50
  Route2 0.508: K1.4 19.05,37.69 R10.1
N$51
  Bottom 0.762: R13.2 125.73,37.25 114.36,25.88 K2.4
N$53
  Top 0.254: R31.1 188.3,8.17
  Top 0.508: 188.3,8.17 K3.1
N$57
  Top 0.254: K3.3 188.85,21.92
  Top 0.508: 188.85,21.92 R22.2
N$60
  Top 0.254: C7.2 R5.2
N$61  (via drill 0.35)
  Top 0.254: U1.3 100.57,65.43 101.88,66.74 C11.1 103.4,70.14 103.4,72.14 | D3.C 100.08,74.34 100.83,73.59 C7.1 102.75,73.59 C8.1 103.4,72.81 103.4,72.14 | v102.11,70.85 103.4,72.14
  Bottom 0.254: R110.2 100.42,67.19 103.4,70.16 C8.1 103.4,72.14 v102.11,70.85
N$62
  Top 0.254: R20.2 87.4,37.42 C15.1 89.66,35.36 U3.2
N$63
  Top 0.254: R21.2 95.86,37.29 C16.1 94.23,36.12 94.23,33.45 96.77,30.91 U2.2
N$64  (via drill 0.38)
  Top 0.254: U1.11 103,63.87 102.31,63.87 v101.23,62.78 v101.22,62.78
  Bottom 0.254: R107.2 101.18,62.74 v101.22,62.78
N$65
  Top 0.254: L3.1 93.3,66.43 U1.1
N$69
  Top 0.254: C19.1 U3.1
N$73
  Top 0.254: U2.1 C20.1
N$76  (via drill 0.38)
  Top 0.254: U1.7 99.42,63.43 99.95,62.91 v99.95,62.5 | v102.33,61.73 102.23,61.82 102.23,63.16 102.51,63.43 U1.10
  Route15 0.254: v99.95,62.5 100.72,61.73 v102.33,61.73
P_DO
  Top 0.254: R14.1 85.64,43.86 R16.2 R18.2 85.64,39.16 R20.1 | R20.1 85.6,39.16 R20.1 | TP13.1 84.33,36.62 84.33,38.27 85.18,39.12 R20.1
PACK+  (via drill 0.38, 1.14)
  Top 0.254: v168.53,32.73 157.48,43.78 157.48,75.02 134.24,98.26 v134.24,98.34 | v115.7,103.29 112.61,103.29 TP6.1 | K3.4 197.24,22.87 J3.5
  Route2 0.254: v134.24,98.34 132.82,99.76 119.23,99.76 v115.7,103.29
  Route2 0.762: J3.5 188.8,32.73 v168.53,32.73 162.23,39.03 119.51,39.03 112.99,32.52 74.84,32.52 K1.1
PACK+FUSED  (via drill 0.38)
  Top 0.254: R22.1 188.72,28.36 v188.34,28.74 | v103.89,30.27 103.89,49.57 v102.87,50.59 102.87,54.52 v105.79,57.45 | TP8.1 110.24,97.46 v110.24,95.8 | v85.72,50.59 85.72,49.02 R11.2
  Route2 0.254: v105.79,57.45 109.22,60.87 109.22,94.78 v110.24,95.8
  Route2 0.508: v102.87,50.59 v85.72,50.59 | v188.34,28.74 167.13,28.74 160.15,35.73 120.27,35.73 114.81,30.27 v103.89,30.27
PRECHARGE_OK  (via drill 0.38)
  Top 0.254: TP18.1 9.4,11.22 26.03,11.22 | R29.2 26.92,10.33 26.03,11.22 | 26.03,11.22 27.65,11.22 v27.91,10.96
  Route15 0.254: J4.3 39.93,8.87 39.93,8.86 38.1,7.03 35.05,7.03 31.84,10.24 31.83,10.24 30.89,11.18 27.93,11.18 27.93,10.98 v27.91,10.96
  Bottom 0.254: J4.3 39.93,8.14 42.18,5.88 47.88,5.88 51.18,9.19 51.18,12.11 52.83,13.76 59.18,13.76 59.56,13.38 59.56,11.98 58.97,11.38 U100.1
SHDN  (via drill 0.38)
  Top 0.254: v20.83,10.07 20.59,9.83 R30.2 15.38,9.83 TP21.1 | K2.2 164.78,8.17 R31.2
  Route15 0.762: K2.2 136.35,4.99 77.85,4.99 76.22,6.62 44.44,6.62 42.47,8.59 J4.2
  Bottom 0.254: v20.83,10.07 22.73,11.98 32.38,11.98 33.24,11.12 41.31,11.12 42.47,9.95 J4.2
  Bottom 0.762: 52.65,23.03 50.16,20.54 50.16,9.69 47.29,6.82 44.24,6.82 42.47,8.59 J4.2 | K1.2 52.83,23.21 52.65,23.03 | D101.C 52.65,23.03 | D100.C 151.97,20.62 K2.2
TS+5V  (via drill 0.38)
  Top 0.254: C14.1 C13.1 106.89,63.51 C12.1 104.46,62.93 U1.9 103.07,61.33 102.11,60.37 94.54,60.37 L3.2 91.82,57.64 91.82,34.33 v92.46,33.7 95.49,30.66 C18.1 C22.1 95.49,24.69 U2.3 | U3.3 88.39,26.57 C21.1 C17.1 88,30.6 v88.65,31.25 | C14.1 108.61,63.58 R6.2 | C14.1 R9.1 111.97,61.6 113.03,62.65 113.03,73.83 v112.01,74.84 | v100.2,103.55 100.29,103.46 TP3.1
  Route15 0.254: v112.01,74.84 99.06,87.8 99.06,102.4 v100.2,103.55
  Bottom 0.254: v92.46,33.7 90,31.25 v88.65,31.25
TS+FUSED  (via drill 0.38, 0.76)
  Top 0.254: 120.08,88.75 120.08,89.32 116.67,89.32 R2.1 | v98.3,55.29 97.28,54.27 R12.2
  Top 0.508: 120.08,88.75 119.38,89.45 F1.2 | F1.2 120.08,89.34 120.08,89.32 | F1.2 120.84,90.32 | L2.2 95.27,78.06 R3.2 97.95,78.06 98.81,78.91 v98.81,79.29
  Top 0.762: 120.84,90.32 120.84,95.36 v120.9,95.42
  Route2 0.508: J3.4 203.2,33.41 203.2,72.05 198.5,76.75 156.84,76.75 136.91,96.69 122.17,96.69 v120.9,95.42 | v98.3,55.29 109.98,55.29 114.17,59.48 114.17,93.01 114.17,94.15
  Route2 1.372: v120.9,95.42 115.44,95.42 114.17,94.15 108.84,99.48 | 105.41,99.48 98.81,92.88 v98.81,79.29
  Route2 1.524: 108.84,99.48 105.41,99.48
TS+UNFUSED  (via drill 0.76)
  Top 0.254: F1.1 132.38,91.35 132.38,97.65 TP10.1
  Top 0.508: v135.76,88.43 134.75,89.45 F1.1 | J3.2 193.26,37.86 181.29,25.88 K2.1
  Route2 0.508: 154.3,69.89 154.3,69.38 143.51,58.59 117.09,58.59 111.63,53.13 82.55,53.13 72.39,63.29 R7.1 69.85,63.16 R10.2
  Route2 1.372: J3.1 J3.2 194.36,42.16 194.36,65.53 189.99,69.89 154.3,69.89 v135.76,88.43
TS-FUSED  (via drill 0.35, 0.38, 0.76)
  Top 0.254: C13.2 C14.2 109.77,65.05 D4.1 | C13.2 106.63,65.36 C12.2 | U1.16 103.95,66.43 C12.2 | v106.93,66.21 C13.2 | U1.6 98.18,63.93 97.92,63.67 97.92,63.16 98.14,62.93 U1.8 98.04,62.12 v98.04,62.02 | 119.51,76.12 F2.2 116.27,76.12 113.41,78.98 C3.2 113.41,81.34 v112.59,82.16 110.31,82.16 109.24,83.23 C4.2 107.95,83.5 107.95,85.51 105.81,87.65 C2.2 | U3.4 86.49,25.3 86.49,26.95 C21.2 C17.2 86.5,31.3 v86.74,31.54 | U2.4 94.12,24.79 94.12,26.71 C22.2 C18.2 93.85,28.22 C19.2 90.93,30.39 v91.69,31.16 | v107.57,101.13 106.3,99.86 TP7.1 | v90.55,42.33 90.55,41.19 88.38,39.02 C15.2 87.5,40.9 87.34,41.06 | v93.22,42.33 93.22,40.43 94.63,39.02 C16.2 95.67,39.06 R19.1 R17.1 | v98.04,31.16 C20.2 | C5.2 C8.2 | U103.5 66.49,78.97 D2.1 | R18.1 87.34,41.06 | 87.34,41.06 R16.1 | C12.2 105.03,68.47 C11.2 108.08,68.62 108.84,69.38 108.84,71.54 108.95,71.65 C8.2 | v106.55,73.57 107.19,72.94 C8.2
  Top 0.508: v122.81,69.51 119.51,72.81 119.51,76.12 | v76.2,73.96 77,73.16 C6.2 84.27,70.04 C9.2 C10.2
  Route15 0.254: v122.81,69.51 122.81,85.89 v107.57,101.13
  Route15 0.508: 110.24,69.51 v106.93,66.21 106.93,63.41 104.01,60.49 99.57,60.49 v98.04,62.02
  Route15 1.372: J2.2 195.34,58.59 133.73,58.59 v122.81,69.51 110.24,69.51 87.88,69.51 83.44,73.96 v76.2,73.96 69.21,73.96 66.49,76.68 U103.5
  Bottom 0.254: R108.1 106.89,66.17 v106.93,66.21 | v90.55,42.33 91.44,42.33 | 91.44,42.33 v93.22,42.33 94.83,42.33 95.38,42.88 95.38,55.92 99.48,60.02 R107.1 98.72,62.02 v98.04,62.02 | 91.44,42.33 91.44,36.11 | 91.44,36.11 92.07,35.47 95.5,35.47 98.04,32.93 v98.04,31.16 v91.69,31.16 | 91.44,36.11 91.31,36.11 v86.74,31.54 83.69,28.49 K100.3 | R111.2 67.17,78.29 66.49,78.97 U103.5 | R112.1 111.34,82.16 v112.59,82.16 | C8.2 107.19,72.94 v106.55,73.57
  Bottom 0.508: J2.1 J2.2
TS-UNFUSED  (via drill 0.38, 0.76)
  Top 0.254: TP11.1 122.9,99.63 126.9,95.63 v126.97,95.63
  Top 0.508: v138.68,75.73 130.96,75.73 F2.1
  Route15 0.254: v138.68,75.73 138.68,91.35 134.41,95.63 v126.97,95.63
  Route15 1.372: J2.5 194.56,54.03 183.15,54.03 R13.1
  Bottom 0.508: R13.1 R8.1 163.45,75.73 v138.68,75.73
TS_DO
  Top 0.254: R15.1 97.37,43.43 R17.2 R19.2 97.41,40.39 R21.1 98.59,38.99 99.06,38.52 99.06,37.13 TP12.1
TSMP+  (via drill 0.76)
  Top 0.254: TP4.1 132.59,103.31 165.1,70.8 165.1,43.6 173.84,34.86 v179.07,34.86
  Route2 0.508: J3.3 v179.07,34.86 172.32,34.86 165.86,41.32 118.24,41.32 112.42,35.5 78.59,35.5 75.44,38.65 36.07,38.65 26.67,48.05 26.67,58.84 22.22,63.29 R7.2
TSMP-  (via drill 0.38, 0.76)
  Top 0.254: v125.09,105.58 123.06,105.58 121.47,103.99 TP5.1
  Route15 0.508: J2.4 196,55.59 130.37,55.59 v130.21,55.43
  Bottom 0.254: v125.09,105.58 130.17,100.5 130.17,55.43 v130.21,55.43 125.73,59.91 R8.2

## Text on the board
tPlace: DCDC+ | DCDC | DCDC- | TS+5V | PACK+ | TSMP- | TSMP+ | LR8_O | TS-F | PACK+F | TS-U | TS+U | TS- | TS+ | IT- | IT+ | IP- | PC_OK | 12V+ | 5V+ | HyTech Racing 2022 / TSB Rev4 / Designed by Cody Kaminsky | SHDN | PC_RE | DCDC_E | PC_OK | 12V+ | GND | SHDN
tNames: IP+ | 5V+